# EAGLE design BalanceBot (EAGLE 9.6.2)
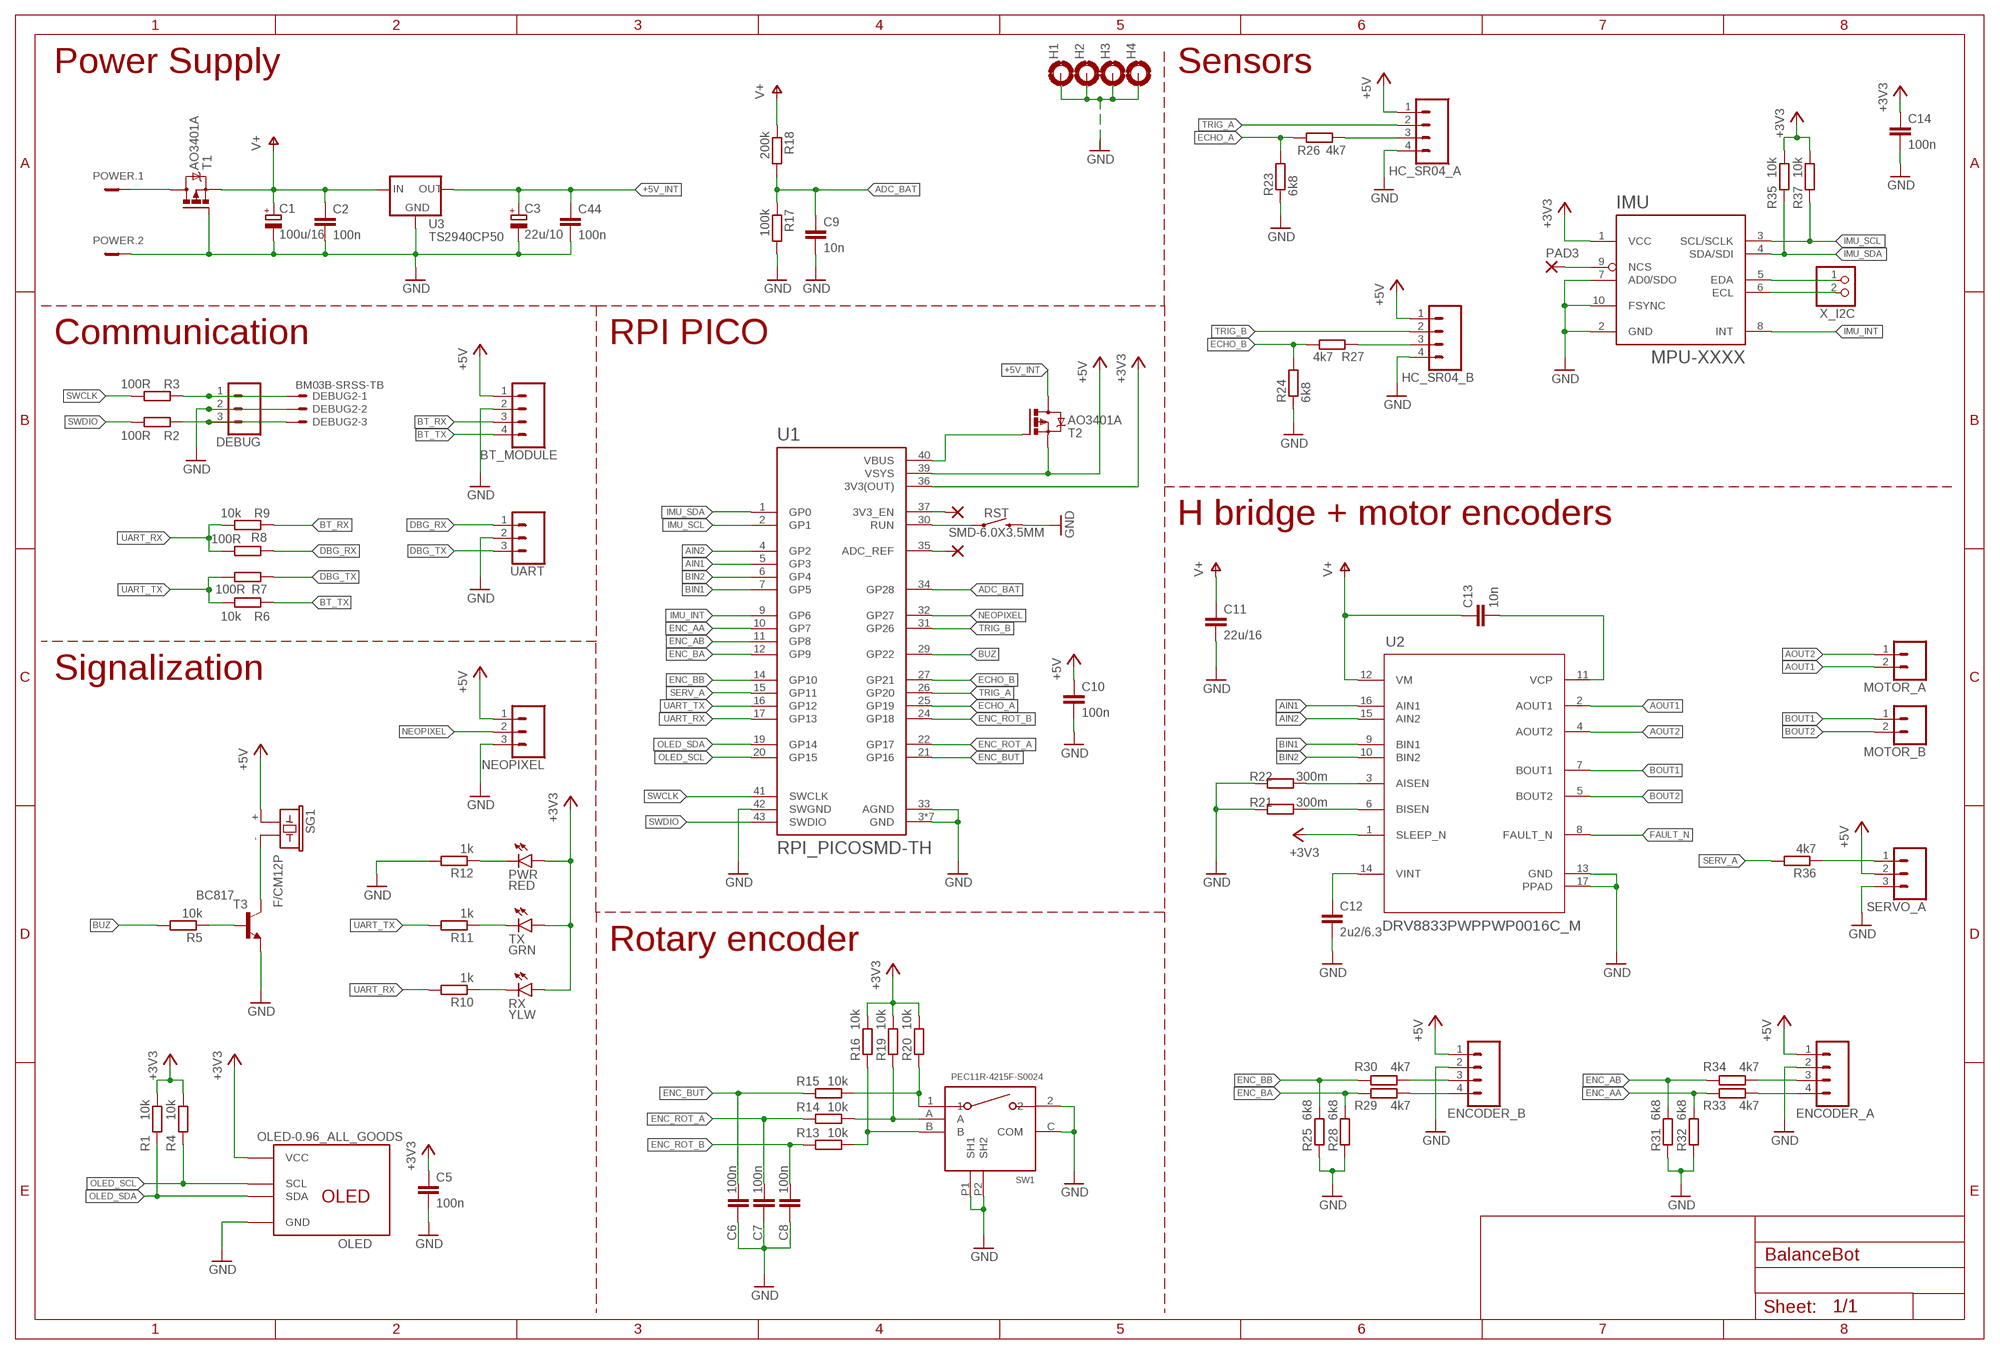
[diagram p0: schematic, sheet 1]

## Parts
BT_MODULE  JST-XH-04-PIN-LONG-PAD  [JST-XH-04-PACKAGE-LONG-PAD]
C1  100u/16  CPOL-EUE2-5  [E2-5]
C2  100n  C-EUC0805  [C0805]
C3  22u/10  CPOL-EUSMCB  [SMC_B]
C5  100n  C-EUC0805  [C0805]
C6  100n  C-EUC0805  [C0805]
C7  100n  C-EUC0805  [C0805]
C8  100n  C-EUC0805  [C0805]
C9  10n  C-EUC0805  [C0805]
C10  100n  C-EUC0805  [C0805]
C11  22u/16  C-EUC0805  [C0805]
C12  2u2/6.3  C-EUC0805  [C0805]
C13  10n  C-EUC0805  [C0805]
C14  100n  C-EUC0805  [C0805]
C44  100n  C-EUC0805  [C0805]
DEBUG  JST-XH-03-PIN-LONG-PAD  [JST-XH-03-PACKAGE-LONG-PAD]
DEBUG2  BM03B-SRSS-TB  [BM03B-SRSS-TB]
ENCODER_A  JST-XH-04-PIN-LONG-PAD  [JST-XH-04-PACKAGE-LONG-PAD]
ENCODER_B  JST-XH-04-PIN-LONG-PAD  [JST-XH-04-PACKAGE-LONG-PAD]
H1  MOUNT-PAD-ROUND3.2  [3,2-PAD]
H2  MOUNT-PAD-ROUND3.2  [3,2-PAD]
H3  MOUNT-PAD-ROUND3.2  [3,2-PAD]
H4  MOUNT-PAD-ROUND3.2  [3,2-PAD]
HC_SR04_A  JST-XH-04-PIN-LONG-PAD  [JST-XH-04-PACKAGE-LONG-PAD]
HC_SR04_B  JST-XH-04-PIN-LONG-PAD  [JST-XH-04-PACKAGE-LONG-PAD]
IMU  MPU-XXXX  [MPUXXXX]
MOTOR_A  JST-XH-02-PIN-LONG-PAD  [JST-XH-02-PACKAGE-LONG-PAD]
MOTOR_B  JST-XH-02-PIN-LONG-PAD  [JST-XH-02-PACKAGE-LONG-PAD]
NEOPIXEL  JST-XH-03-PIN-LONG-PAD  [JST-XH-03-PACKAGE-LONG-PAD]
OLED  OLED-0.96_ALL_GOODS  [ALL_GOODS]
PAD1  WIREPADSMD1,27-254  [SMD1,27-2,54]
PAD2  WIREPADSMD1,27-254  [SMD1,27-2,54]
PAD3  WIREPADSMD1,27-254  [SMD1,27-2,54]
POWER  MCV2  [MCV2]
PWR  RED  LEDCHIP-LED0805  [CHIP-LED0805]
R1  10k  R-EU_R0805  [R0805]
R2  100R  R-EU_R0805  [R0805]
R3  100R  R-EU_R0805  [R0805]
R4  10k  R-EU_R0805  [R0805]
R5  10k  R-EU_R0805  [R0805]
R6  10k  R-EU_R0805  [R0805]
R7  100R  R-EU_R0805  [R0805]
R8  100R  R-EU_R0805  [R0805]
R9  10k  R-EU_R0805  [R0805]
R10  1k  R-EU_R0805  [R0805]
R11  1k  R-EU_R0805  [R0805]
R12  1k  R-EU_R0805  [R0805]
R13  10k  R-EU_R0805  [R0805]
R14  10k  R-EU_R0805  [R0805]
R15  10k  R-EU_R0805  [R0805]
R16  10k  R-EU_R0805  [R0805]
R17  100k  R-EU_R0805  [R0805]
R18  200k  R-EU_R0805  [R0805]
R19  10k  R-EU_R0805  [R0805]
R20  10k  R-EU_R0805  [R0805]
R21  300m  R-EU_R1206  [R1206]
R22  300m  R-EU_R1206  [R1206]
R23  6k8  R-EU_R0805  [R0805]
R24  6k8  R-EU_R0805  [R0805]
R25  6k8  R-EU_R0805  [R0805]
R26  4k7  R-EU_R0805  [R0805]
R27  4k7  R-EU_R0805  [R0805]
R28  6k8  R-EU_R0805  [R0805]
R29  4k7  R-EU_R0805  [R0805]
R30  4k7  R-EU_R0805  [R0805]
R31  6k8  R-EU_R0805  [R0805]
R32  6k8  R-EU_R0805  [R0805]
R33  4k7  R-EU_R0805  [R0805]
R34  4k7  R-EU_R0805  [R0805]
R35  10k  R-EU_R0805  [R0805]
R36  4k7  R-EU_R0805  [R0805]
R37  10k  R-EU_R0805  [R0805]
RST  SMD-6.0X3.5MM  MOMENTARY-SWITCH-SPST-SMD-6.0X3.5MM  [TACTILE_SWITCH_SMD_6.0X3.5MM]
RX  YLW  LEDCHIP-LED0805  [CHIP-LED0805]
SERVO_A  JST-XH-03-PIN-LONG-PAD  [JST-XH-03-PACKAGE-LONG-PAD]
SG1  F/CM12P  [F/CM12P]
SW1  PEC11R-4215F-S0024  [PEC11R-4215F-S0024]
T1  AO3401A  PMOSFET_SOT23-GSD  [SOT23]
T2  AO3401A  PMOSFET_SOT23-GSD  [SOT23]
T3  BC817  BC817-NPN-SOT23-BEC  [SOT23-BEC]
TX  GRN  LEDCHIP-LED0805  [CHIP-LED0805]
U1  RPI_PICOSMD-TH  RASPBERRY_PICOTH-ONLY  [PICO-PKG-TH-ONLY]
U2  DRV8833PWPPWP0016C_M  [PWP0016C_M]
U3  TS2940CP50  LP2950CDT-5.0  [DPACK]
UART  JST-XH-03-PIN-LONG-PAD  [JST-XH-03-PACKAGE-LONG-PAD]
X_I2C  PINHD-1X2  [1X02]

## Nets
3V3_EN: PAD2.1(P) U1.37(3V3_EN)
+3V3: C5.1 C14.1 IMU.1(VCC) OLED.2(VCC) PWR.A R1.1 R4.1 R16.1 R19.1 R20.1 R35.1 R37.1 RX.A TX.A U1.36(3V3(OUT)) U2.1(SLEEP_N)
+5V: BT_MODULE.1 C10.1 ENCODER_A.1 ENCODER_B.1 HC_SR04_A.1 HC_SR04_B.1 NEOPIXEL.1 SERVO_A.2 SG1.+ T2.2(S) U1.39(VSYS)
+5V_INT: C3.+ C44.1 T2.3(D) U3.3(OUT)
ADC_BAT: C9.1 R17.1 R18.2 U1.34(GP28)
ADC_REF: PAD1.1(P) U1.35(ADC_REF)
AIN1: U1.5(GP3) U2.16(AIN1)
AIN2: U1.4(GP2) U2.15(AIN2)
AOUT1: MOTOR_A.2 U2.2(AOUT1)
AOUT2: MOTOR_A.1 U2.4(AOUT2)
BIN1: U1.7(GP5) U2.9(BIN1)
BIN2: U1.6(GP4) U2.10(BIN2)
BOUT1: MOTOR_B.1 U2.7(BOUT1)
BOUT2: MOTOR_B.2 U2.5(BOUT2)
BT_RX: BT_MODULE.3 R9.1
BT_TX: BT_MODULE.4 R6.1
BUZ: R5.2 U1.29(GP22)
DBG_RX: R8.1 UART.1
DBG_TX: R7.1 UART.3
ECHO_A: R23.2 R26.1 U1.25(GP19)
ECHO_B: R24.2 R27.1 U1.27(GP21)
ECL: IMU.6(ECL) X_I2C.2
EDA: IMU.5(EDA) X_I2C.1
ENC_AA: R32.2 R33.1 U1.10(GP7)
ENC_AB: R31.2 R34.2 U1.11(GP8)
ENC_BA: R28.2 R29.1 U1.12(GP9)
ENC_BB: R25.2 R30.2 U1.14(GP10)
ENC_BUT: C6.1 R15.1 U1.21(GP16)
ENC_ROT_A: C7.1 R14.1 U1.22(GP17)
ENC_ROT_B: C8.1 R13.1 U1.24(GP18)
FAULT_N: U2.8(FAULT_N)
GND: BT_MODULE.2 C1.- C2.2 C3.- C5.2 C6.2 C7.2 C8.2 C9.2 C10.2 C11.2 C12.2 C14.2 C44.2 DEBUG2.2 DEBUG.2 ENCODER_A.2 ENCODER_B.2 H1.B3,2(MOUNT) H2.B3,2(MOUNT) H3.B3,2(MOUNT) H4.B3,2(MOUNT) HC_SR04_A.4 HC_SR04_B.4 IMU.2(GND) IMU.7(AD0/SDO) IMU.10(FSYNC) NEOPIXEL.3 OLED.1(GND) POWER.2 R12.2 R17.2 R21.1 R22.1 R23.1 R24.1 R25.1 R28.1 R31.1 R32.1 RST.2 SERVO_A.3 SW1.2 SW1.C(COM) SW1.P1(SH1) SW1.P2(SH2) T1.1(G) T3.E U1.3(GND) U1.8(GND) U1.13(GND) U1.18(GND) U1.23(GND) U1.28(GND) U1.33(AGND) U1.38(GND) U1.42(SWGND) U2.13(GND) U2.17(PPAD) U3.4(GND) UART.2
IMU_INT: IMU.8(INT) U1.9(GP6)
IMU_SCL: IMU.3(SCL/SCLK) R37.2 U1.2(GP1)
IMU_SDA: IMU.4(SDA/SDI) R35.2 U1.1(GP0)
N$1: R22.2 U2.3(AISEN)
N$2: R21.2 U2.6(BISEN)
N$3: C13.2 U2.11(VCP)
N$4: C12.1 U2.14(VINT)
N$8: POWER.1 T1.3(D)
N$9: PWR.C R12.1
N$10: R11.1 TX.C
N$11: R15.2 R20.2 SW1.1
N$12: R5.1 T3.B
N$13: R14.2 R19.2 SW1.A
N$14: SG1.- T3.C
N$15: R13.2 R16.2 SW1.B
N$20: R10.1 RX.C
N$23: HC_SR04_A.3 R26.2
N$24: HC_SR04_B.3 R27.2
N$25: ENCODER_A.3 R34.1
N$26: ENCODER_A.4 R33.2
N$27: ENCODER_B.3 R30.1
N$28: ENCODER_B.4 R29.2
N$30: DEBUG2.1 DEBUG.1 R3.1
N$32: R36.1 SERVO_A.1
N$33: DEBUG2.3 DEBUG.3 R2.2
NCS: IMU.9(NCS) PAD3.1(P)
NEOPIXEL: NEOPIXEL.2 U1.32(GP27)
OLED_SCL: OLED.3(SCL) R4.2 U1.20(GP15)
OLED_SDA: OLED.4(SDA) R1.2 U1.19(GP14)
RUN: RST.1 U1.30(RUN)
SERV_A: R36.2 U1.15(GP11)
SWCLK: R3.2 U1.41(SWCLK)
SWDIO: R2.1 U1.43(SWDIO)
TRIG_A: HC_SR04_A.2 U1.26(GP20)
TRIG_B: HC_SR04_B.2 U1.31(GP26)
UART_RX: R8.2 R9.2 R10.2 U1.17(GP13)
UART_TX: R6.2 R7.2 R11.2 U1.16(GP12)
V+: C1.+ C2.1 C11.1 C13.1 R18.1 T1.2(S) U2.12(VM) U3.1(IN)
VBUS: T2.1(G) U1.40(VBUS)

## Notes on the sheet
- Power Supply | Sensors
- Communication | RPI PICO
- H bridge + motor encoders
- Signalization
- Rotary encoder

## Library data of the parts
BT_MODULE ENCODER_A ENCODER_B HC_SR04_A HC_SR04_B = JST-XH-2.54:JST-XH-04-PIN: JST XH Connector 2 Pin Wire to board connector. Pitch: 2,54 mm, (0.100") Number of pins: 4 Created by Rembrandt Electronics www.rembrandtelectronics.com
C1 C3 = rcl:CPOL-EU: POLARIZED CAPACITOR, European symbol; SPICEPREFIX: C
C2 C5-C14 C44 = rcl:C-EU: CAPACITOR, European symbol; SPICEPREFIX: C
DEBUG NEOPIXEL SERVO_A UART = JST-XH-2.54:JST-XH-03-PIN: JST XH Connector 2 Pin Wire to board connector. Pitch: 2,54 mm, (0.100") Number of pins: 3 Created by Rembrandt Electronics www.rembrandtelectronics.com
DEBUG2 = con-jst2:?M03B-SRSS-TB: Disconnectable Crimp style connector, 1.0mm pitch 3 contacts
H1-H4 = tcs_holes:MOUNT-PAD-ROUND: MOUNTING PAD, round
IMU = MPU_sensors:MPU-XXXX
MOTOR_A MOTOR_B = JST-XH-2.54:JST-XH-02-PIN: JST XH Connector 2 Pin Wire to board connector. Pitch: 2,54 mm, (0.100") Number of pins: 2 Created by Rembrandt Electronics www.rembrandtelectronics.com
OLED = oled:OLED-0.96_
PAD1-PAD3 = wirepad:WIREPAD: Wire PAD connect wire on PCB
POWER = con-phoenix-381_l:MCV2: Mini-Combicon 3.81mm vertikal 2polig MCV 1,5/2-G-3,81 Artikel-Nr. 1803426
PWR RX TX = led:LED: LED OSRAM: - CHIPLED LG R971, LG N971, LY N971, LG Q971, LY Q971, LO R971, LY R971 LH N974, LH R974 LS Q976, LO Q976, LY Q976 LO Q996 - Hyper CHIPLED LW Q18S LB Q993, LB Q99A, LB R99A - SideLED LS A670, LO A670, LY A670, LG A670, LP A670 LB A673, LV A673, LT A673, LW A673 LH A674 LY A675 LS A676, LA A676, LO A676, LY A676, LW A676 LS A679, LY A679, LG A679 - Hyper Micro SIDELED® LS Y876, LA Y876, LO Y876, LY Y876 LT Y87S - SmartLED LW L88C, LW L88S LB L89C, LB L89S, LG L890 LS L89K, LO L89K, LY L89K LS L896, LA L896, LO L896, LY L896 - TOPLED LS T670, LO T670, LY T670, LG T670, LP T670 LSG T670, LSP T670, LSY T670, LOP T670, LYG T670 LG T671, LOG T671, LSG T671 LB T673, LV T673, LT T673, LW T673 LH T674 LS T676, LA T676, LO T676, LY T676, LB T676, LH T676, LSB T676, LW T676 LB T67C, LV T67C, LT T67C, LS T67K, LO T67K, LY T67K, LW E67C LS E67B, LA E67B, LO E67B, LY E67B, LB E67C, LV E67C, LT E67C LW T67C LS T679, LY T679, LG T679 LS T770, LO T770, LY T770, LG T770, LP T770 LB T773, LV T773, LT T773, LW T773 LH T774 LS E675, LA E675, LY E675, LS T675 LS T776, LA T776, LO T776, LY T776, LB T776 LHGB T686 LT T68C, LB T68C - Hyper Mini TOPLED® LB M676 - Mini TOPLED Santana® LG M470 LS M47K, LO M47K, LY M47K Source: http://www.osram.convergy.de LUXEON: - LUMILED® LXK2-PW12-R00, LXK2-PW12-S00, LXK2-PW14-U00, LXK2-PW14-V00 LXK2-PM12-R00, LXK2-PM12-S00, LXK2-PM14-U00 LXK2-PE12-Q00, LXK2-PE12-R00, LXK2-PE12-S00, LXK2-PE14-T00, LXK2-PE14-U00 LXK2-PB12-K00, LXK2-PB12-L00, LXK2-PB12-M00, LXK2-PB14-N00, LXK2-PB14-P00, LXK2-PB14-Q00 LXK2-PR12-L00, LXK2-PR12-M00, LXK2-PR14-Q00, LXK2-PR14-R00 LXK2-PD12-Q00, LXK2-PD12-R00, LXK2-PD12-S00 LXK2-PH12-R00, LXK2-PH12-S00 LXK2-PL12-P00, LXK2-PL12-Q00, LXK2-PL12-R00 Source: www.luxeon.com KINGBRIGHT: KA-3528ASYC Source: www.kingbright.com
R1-R37 = rcl:R-EU_: RESISTOR, European symbol; SPICEPREFIX: R
RST = SparkFun-Switches:MOMENTARY-SWITCH-SPST: Momentary Switch (Pushbutton) - SPST Normally-open (NO) SPST momentary switches (buttons, pushbuttons). Variants PTH-12MM - 12mm square, through-hole Momentary Pushbutton Switch - 12mm Square <https://www.sparkfun.com/products/9190> (COM-09190) PTH-6.0MM, PTH-6.0MM-KIT - 6.0mm square, through-hole Mini Pushbutton Switch <https://www.sparkfun.com/products/97> (COM-00097) KIT package intended for soldering kit's - only one side of pads' copper is exposed. PTH-RIGHT-ANGLE-KIT - Right-angle, through-hole Right Angle Tactile Button <https://www.sparkfun.com/products/10791> - Used on SparkFun BigTime Watch Kit <https://www.sparkfun.com/products/11734> SMD-12MM - 12mm square, surface-mount Tactile Button - SMD (12mm) <https://www.sparkfun.com/products/12993> (COM-12993) Used on SparkFun PicoBoard <https://www.sparkfun.com/products/11888> SMD-4.5MM - 4.5mm Square Trackball Switch Used on SparkFun Blackberry Trackballer Breakout <https://www.sparkfun.com/products/13169> SMD-4.6MMX2.8MM - 4.60mm x 2.80mm, surface mount Used on SparkFun SAMD21 Mini Breakout <https://www.sparkfun.com/products/13664> SMD-5.2MM, SMD-5.2-REDUNDANT - 5.2mm square, surface-mount Mini Pushbutton Switch - SMD <https://www.sparkfun.com/products/8720> (COM-08720) Used on Arduino Pro Mini <https://www.sparkfun.com/products/11114> REDUNDANT package connects both switch circuits together SMD-6.0X3.5MM - 6.0 x 3.5mm, surface mount Momentary Reset Switch SMD <https://www.sparkfun.com/products/8229> (COM-08229) SMD-6.2MM-TALL - 6.2mm square, surface mount Tactile Button - SMD (6mm) <https://www.sparkfun.com/products/12992> Used on SparkFun Digital Sandbox <https://www.sparkfun.com/products/12651> SMD-RIGHT-ANGLE - Right-angle, surface mount Used on SparkFun Block for Intel® Edison - Arduino <https://www.sparkfun.com/products/13036>; PROD_ID: SWCH-00815; SF_SKU: COM-08229
SG1 = buzzer:F/CM12P: BUZZER Source: Buerklin; OC_FARNELL: unknown; OC_NEWARK: unknown
SW1 = EC11_encoder:PEC11R-4215F-S0024: ROTARY ENCODER MECHANICAL 24PPR Manufacturer's datasheet <https://www.bourns.com/docs/Product-Datasheets/PEC11R.pdf>; CREATED_BY: PCBLayout.com; DIGIKEY_PART_NUMBER: PEC11R-4215F-S0024-ND; MANUFACTURER: Bourns Inc.; MPN: PEC11R-4215F-S0024
T1 T2 = Transistor:PMOSFET: P-Channel MOSFET - Generic; CATEGORY: Transistor; SUB-CATEGORY: MOSFET; TYPE: P-Channel; VALUE: PMOSFET
T3 = transistor:*-NPN-: NPN Transistror BF959 corrected 2008.03.06
U1 = RpiPico:RASPBERRY_PICO: Raspberry Pi Pico
U2 = DRV8833:DRV8833PWP; COPYRIGHT: Copyright (C) 2023 Ultra Librarian. All rights reserved.; MANUFACTURER_PART_NUMBER: DRV8833PWP; MFR_NAME: Texas Instruments; REFDES: RefDes; TYPE: TYPE
U3 = v-reg:LP2950?*: Source: http://cache.national.com/ds/LP/LP2950.pdf
X_I2C = pinhead:PINHD-1X2: PIN HEADER

## Board
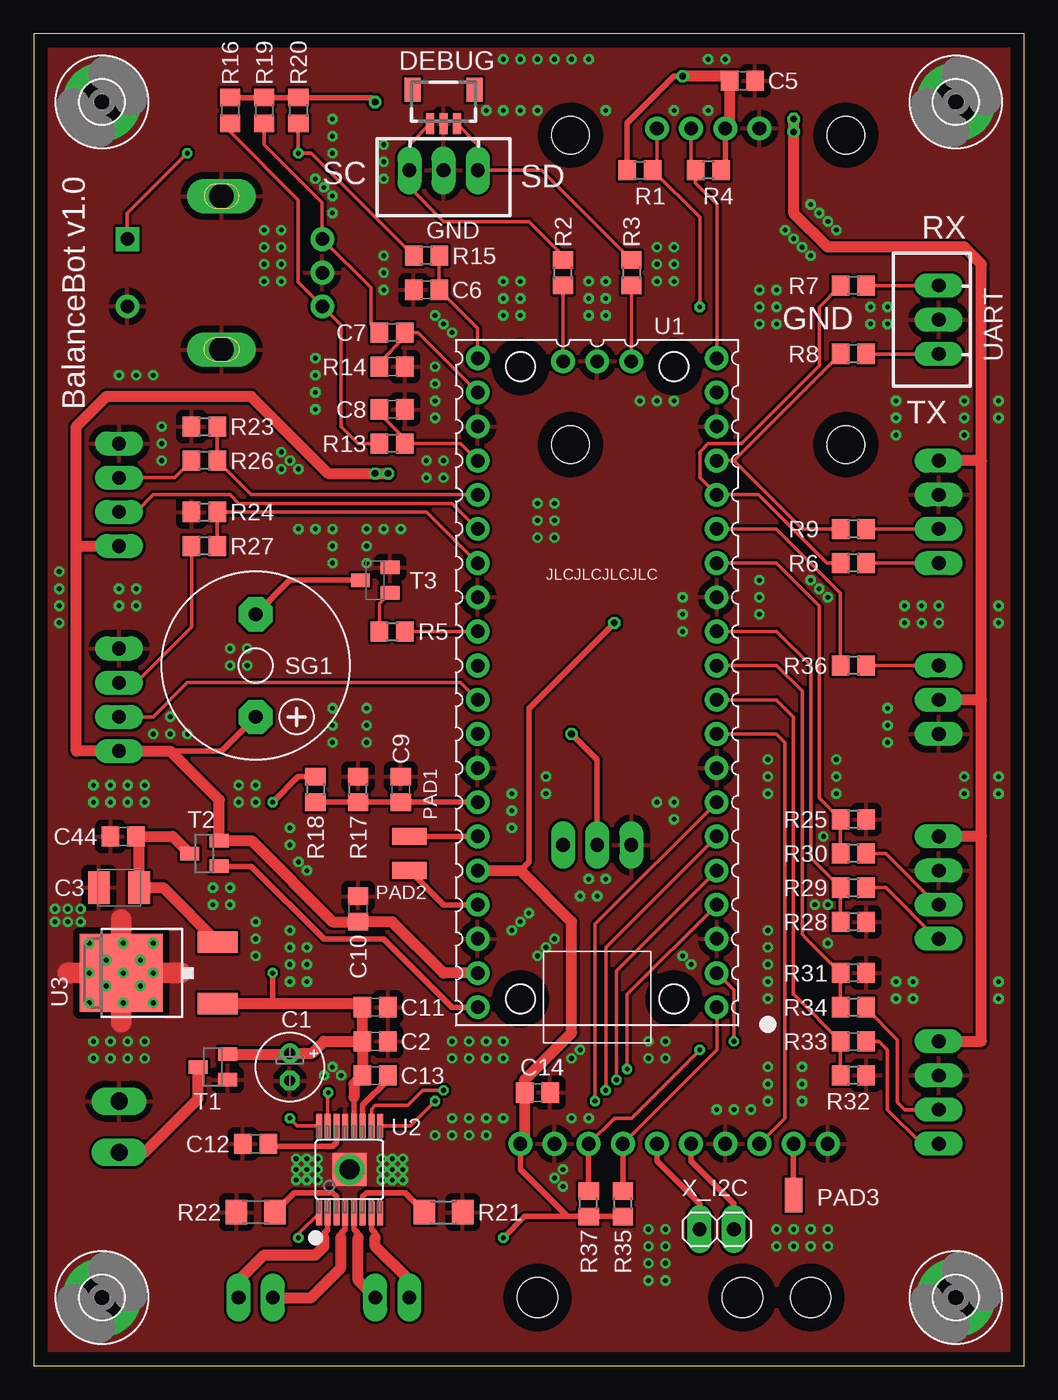
[diagram p1: board, top side]
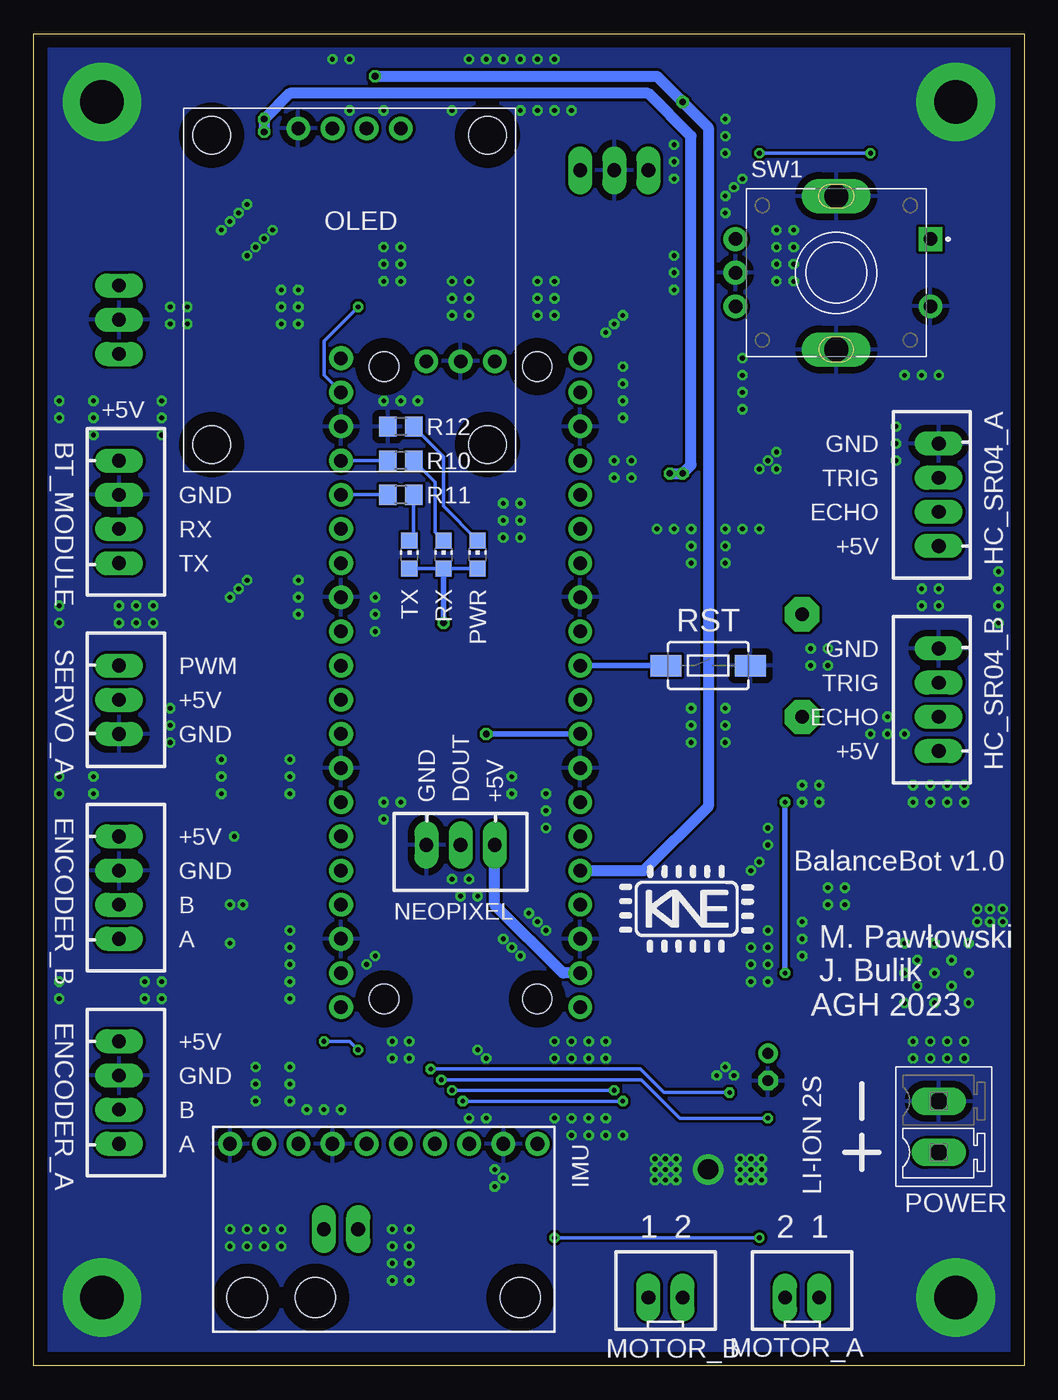
[diagram p2: board, bottom side, seen from below]

Size 73.66 x 99.06 mm. Coordinates in mm from the lower left corner, seen from the top.
Outline: 0,0 73.66,0 73.66,99.06 0,99.06 0,0
Copper layers (1*16): Top 0.035mm / dielectric 1.6mm / Bottom 0.035mm
Design rules "maro_jlc *": minimum track width 8mil, minimum drill 0.35mm, track to track 8mil, track to pad 8mil, pad to pad 8mil, via to via 8mil, smd to smd 8mil, copper to edge 40mil, drill to drill 10mil, minimum pad ring 10mil, minimum via ring 8mil, stop-mask expansion 4mil, vias tented up to drill 0.6mm, thermal gap 20mil

### Footprints (pad centres in the part's own frame; a part is rotated, then mirrored left to right if it is on the bottom)
JST-XH-04-PACKAGE-LONG-PAD = drill 1.016 long: 1 -3.81,0; 2 -1.27,0; 3 1.27,0; 4 3.81,0
E2-5 = drill 0.813 pad 1.27: + -1.016,0 | drill 0.813 pad 1.27 octagon: - 1.016,0
C0805 = smd 1.3 x 1.5: 1 -0.95,0; 2 0.95,0
SMC_B = smd 1.6 x 2.4: + -1.5,0; - 1.5,0
JST-XH-03-PACKAGE-LONG-PAD = drill 1.016 long: 1 -2.54,0; 2 0,0; 3 2.54,0
BM03B-SRSS-TB = smd 0.6 x 1.55: 1 1,-1.625; 2 0,-1.625; 3 -1,-1.625 | smd 1.2 x 1.8: FIT@1 2.3,0.9; FIT@2 -2.3,0.9
3,2-PAD = drill 3.2 pad 5.842: B3,2 0,0
MPUXXXX = drill 1.016: 1 0,11.43; 2 0,8.89; 3 0,6.35; 4 0,3.81; 5 0,1.27; 6 0,-1.27; 7 0,-3.81; 8 0,-6.35; 9 0,-8.89; 10 0,-11.43 | hole 3: 11.43,10.16; 11.43,-10.16; 11.43,-5.08
JST-XH-02-PACKAGE-LONG-PAD = drill 1.016 long: 1 -1.27,0; 2 1.27,0
ALL_GOODS = drill 1.016: 1 -3.81,12; 2 -1.27,12; 3 1.27,12; 4 3.81,12 | hole 2.8: -10.25,11.5; 10.25,11.5; -10.25,-11.5; 10.25,-11.5
SMD1,27-2,54 = smd 1.27 x 2.54: 1 0,0
MCV2 = drill 1.27 pad 1.905 long: 1 -1.905,0; 2 1.905,0
CHIP-LED0805 = smd 1.2 x 1.2: A 0,-1.05; C 0,1.05
R0805 = smd 1.3 x 1.5: 1 -0.95,0; 2 0.95,0
R1206 = smd 1.6 x 1.803: 1 -1.422,0; 2 1.422,0
TACTILE_SWITCH_SMD_6.0X3.5MM = smd 2.3 x 1.6: 1 -3.15,0; 2 3.15,0
F/CM12P = drill 1.016 pad 2.54 octagon: + 3.81,0; - -3.81,0
PEC11R-4215F-S0024 = drill 1 square: 1 -2.5,7 | drill 1: 2 2.5,7; A -2.5,-7.5; B 2.5,-7.5; C 0,-7.5 | drill 1.8 long: P1 -5.7,0; P2 5.7,0
SOT23 = smd 1 x 1.4: 1 -0.95,-1.1; 2 0.95,-1.1; 3 0,1.1
SOT23-BEC = smd 1 x 1.4: B -0.95,-1.1; C 0,1.1; E 0.95,-1.1
PICO-PKG-TH-ONLY = drill 1: 1 -8.89,24.13; 2 -8.89,21.59; 3 -8.89,19.05; 4 -8.89,16.51; 5 -8.89,13.97; 6 -8.89,11.43; 7 -8.89,8.89; 8 -8.89,6.35; 9 -8.89,3.81; 10 -8.89,1.27; 11 -8.89,-1.27; 12 -8.89,-3.81; 13 -8.89,-6.35; 14 -8.89,-8.89; 15 -8.89,-11.43; 16 -8.89,-13.97; 17 -8.89,-16.51; 18 -8.89,-19.05; 19 -8.89,-21.59; 20 -8.89,-24.13; 21 8.89,-24.13; 22 8.89,-21.59; 23 8.89,-19.05; 24 8.89,-16.51; 25 8.89,-13.97; 26 8.89,-11.43; 27 8.89,-8.89; 28 8.89,-6.35; 29 8.89,-3.81; 30 8.89,-1.27; 31 8.89,1.27; 32 8.89,3.81; 33 8.89,6.35; 34 8.89,8.89; 35 8.89,11.43; 36 8.89,13.97; 37 8.89,16.51; 38 8.89,19.05; 39 8.89,21.59; 40 8.89,24.13; 41 -2.54,-23.9; 42 0,-23.9; 43 2.54,-23.9 | hole 2.2: 5.7,-23.5; -5.7,-23.5; -5.7,23.5; 5.7,23.5
PWP0016C_M = smd 1.8 x 0.447: 1 -3.25,2.275; 2 -3.25,1.625; 3 -3.25,0.975; 4 -3.25,0.325; 5 -3.25,-0.325; 6 -3.25,-0.975; 7 -3.25,-1.625; 8 -3.25,-2.275; 9 3.25,-2.275; 10 3.25,-1.625; 11 3.25,-0.975; 12 3.25,-0.325; 13 3.25,0.325; 14 3.25,0.975; 15 3.25,1.625; 16 3.25,2.275 | smd 2.46 x 2.56: 17 0,0
DPACK = smd 1.6 x 3: 1 -2.28,-4.8; 3 2.28,-4.8 | smd 5.8 x 6.2: 4 0,2.38
1X02 = drill 1.016 long: 1 -1.27,0; 2 1.27,0

### Placement (x,y rotation side)
BT_MODULE  67.31,63.5 270 bottom
C1  19.05,22.23 270 top
C2  25.4,24.13 0 top
C3  6.35,35.56 180 top
C5  52.7,95.57 0 top
C6  29.21,80.01 180 top
C7  26.67,74.3 0 top
C8  26.67,71.12 0 top
C9  27.3,42.86 90 top
C10  24.13,33.97 90 top
C11  25.4,26.67 0 top
C12  16.51,16.51 180 top
C13  25.4,21.59 0 top
C14  37.47,20.32 0 top
C44  6.67,39.37 180 top
DEBUG  30.48,88.9 180 top
DEBUG2  30.48,93.98 0 top
ENCODER_A  67.31,20.32 270 bottom
ENCODER_B  67.31,35.56 270 bottom
H1  68.58,5.08 0 top
H2  5.08,5.08 0 top
H3  68.58,93.98 0 top
H4  5.08,93.98 0 top
HC_SR04_A  6.35,64.77 90 bottom
HC_SR04_B  6.35,49.53 90 bottom
IMU  47.62,16.51 270 bottom
MOTOR_A  16.51,5.08 0 bottom
MOTOR_B  26.67,5.08 0 bottom
NEOPIXEL  41.91,38.73 180 bottom
OLED  50.16,80.01 0 bottom
PAD1  27.94,39.37 90 top
PAD2  27.94,36.83 90 top
PAD3  56.52,12.7 0 top
POWER  6.35,17.78 90 bottom
PWR  40.64,60.33 0 bottom
R1  45.09,88.9 0 top
R2  39.37,81.28 90 top
R3  44.45,81.28 270 top
R4  50.16,88.9 180 top
R5  26.67,54.61 0 top
R6  60.96,59.69 180 top
R7  60.96,80.33 180 top
R8  60.96,75.25 180 top
R9  60.96,62.23 180 top
R10  46.35,67.31 180 bottom
R11  46.35,64.77 180 bottom
R12  46.35,69.85 180 bottom
R13  26.67,68.58 180 top
R14  26.67,76.83 180 top
R15  29.21,82.55 180 top
R16  14.61,93.34 270 top
R17  24.13,42.86 90 top
R18  20.95,42.86 270 top
R19  17.14,93.34 270 top
R20  19.68,93.34 270 top
R21  30.48,11.43 180 top
R22  16.51,11.43 0 top
R23  12.7,69.85 0 top
R24  12.7,63.5 0 top
R25  60.96,40.64 180 top
R26  12.7,67.31 180 top
R27  12.7,60.96 180 top
R28  60.96,33.02 180 top
R29  60.96,35.56 0 top
R30  60.96,38.1 180 top
R31  60.96,29.21 180 top
R32  60.96,21.59 180 top
R33  60.96,24.13 0 top
R34  60.96,26.67 180 top
R35  43.81,12.06 90 top
R36  60.96,52.07 180 top
R37  41.27,12.06 90 top
RST  23.5,52.07 0 bottom
RX  43.18,60.33 0 bottom
SERVO_A  67.31,49.53 270 bottom
SG1  16.51,52.07 270 top
SW1  13.97,81.28 270 bottom
T1  13.34,22.23 90 top
T2  12.7,38.1 90 top
T3  25.4,58.42 90 top
TX  45.72,60.33 0 bottom
U1  41.91,50.8 180 top
U2  23.5,14.61 90 top
U3  8.89,29.21 90 top
UART  67.31,77.79 90 top
X_I2C  50.8,10.16 0 top

### Tracks (layer width: path | path; a pad name or v marks a point on that pad's centre or on a via)
3V3_EN
  Top 0.406: U1.37 30.48,34.29 PAD2.1
+3V3  (via drill 0.35, 0.5)
  Top 0.254: v19.68,9.53 19.68,9.82 U2.1
  Top 0.406: 39.69,11.12 R37.1 R35.1 | 39.69,11.12 36.2,14.61 IMU.1 | OLED.2 51.44,89.22 R4.1 | v48.26,95.89 47.62,95.89 44.13,92.39 R1.1 | R16.1 R19.1 R20.1 25.09,94.3 v25.4,93.98 | v34.92,9.53 36.52,11.12 39.69,11.12 | 36.2,36.83 36.83,37.47 36.83,48.9 v43.18,55.24
  Top 0.813: IMU.1 36.52,16.83 C14.1 36.52,21.27 40.01,24.77 40.01,33.02 36.2,36.83 U1.36 | v48.26,95.89 51.44,95.89 C5.1 51.76,92.33 OLED.2
  Bottom 0.254: v19.68,9.53 v34.92,9.53 | PWR.A RX.A TX.A
  Bottom 0.406: v43.18,55.24 RX.A
  Bottom 0.813: v48.26,95.89 27.3,95.89 v25.4,93.98 23.5,92.08 23.5,41.59 28.26,36.83 U1.36
+5V  (via drill 0.5)
  Top 0.406: 10.16,45.72 13.97,45.72 SG1.+
  Top 0.813: 3.17,60.96 3.17,45.72 HC_SR04_B.1 10.16,45.72 13.8,42.08 T2.2 16.2,39.05 22.22,33.02 C10.1 26.67,33.02 30.48,29.21 U1.39 | 3.17,60.96 HC_SR04_A.1 | ENCODER_A.1 70.48,24.13 70.48,39.37 | 70.48,39.37 ENCODER_B.1 | 70.48,39.37 70.48,49.53 | 70.48,49.53 SERVO_A.2 | 70.48,49.53 70.48,67.31 | 70.48,67.31 BT_MODULE.1 | 3.17,60.96 3.17,69.85 5.4,72.07 16.19,72.07 21.91,66.36 v25.4,66.36 v26.35,66.36 | 70.48,67.31 70.48,81.92 69.22,83.19 59.05,83.19 56.52,85.72 v56.52,91.76 v56.52,92.71
  Bottom 0.813: v26.35,66.36 v25.4,66.36 24.77,66.99 24.77,91.44 27.94,94.61 54.61,94.61 v56.52,92.71 v56.52,91.76 | U1.39 34.29,29.21 39.37,34.29 NEOPIXEL.1
+5V_INT
  Top 0.813: T2.3 10.33,39.37 C44.1 7.85,39.14 C3.+ 9.62,35.56 U3.3
ADC_BAT
  Top 0.406: R18.2 R17.1 C9.1 U1.34
ADC_REF
  Top 0.406: PAD1.1 U1.35
AIN1  (via drill 0.35)
  Top 0.254: U2.16 19.61,17.86 v19.05,18.41 | v43.34,21.27 43.34,29.37 U1.5
  Bottom 0.254: v19.05,18.41 25.6,18.41 28.45,21.27 v43.34,21.27
AIN2  (via drill 0.35)
  Top 0.254: U2.15 21.87,20.28 v21.91,20.32 | U1.4 44.13,27.62 v44.13,22.07
  Bottom 0.254: v21.91,20.32 26.78,20.32 28.53,22.07 v44.13,22.07
AOUT1
  Top 0.406: U2.2 21.87,10.12 21.59,9.84 21.59,9.53
  Top 0.813: MOTOR_A.2 15.24,6.35 17.14,8.26 20.95,8.26 21.59,8.89 21.59,9.53
AOUT2
  Top 0.406: U2.4 23.17,10.16 22.86,9.85 22.86,9.53
  Top 0.813: MOTOR_A.1 20.64,5.08 22.86,7.3 22.86,9.53
BIN1  (via drill 0.35)
  Top 0.254: v29.84,19.68 28.02,17.86 U2.9 | U1.7 41.75,32.86 v41.75,19.68
  Bottom 0.254: v41.75,19.68 v29.84,19.68
BIN2  (via drill 0.35)
  Top 0.254: U2.10 25.12,19.09 25.4,19.37 27.82,19.37 28.93,20.48 v30.48,20.48 | v42.55,20.48 42.55,31.11 U1.6
  Bottom 0.254: v42.55,20.48 v30.48,20.48
BOUT1
  Top 0.406: U2.7 25.12,10.16 25.4,9.88 25.4,9.53
  Top 0.813: MOTOR_B.1 27.94,6.35 25.4,8.89 25.4,9.53
BOUT2
  Top 0.406: U2.5 23.82,10.16 24.13,9.85 24.13,9.53
  Top 0.813: MOTOR_B.2 24.13,6.35 24.13,9.53
BT_RX
  Top 0.254: R9.1 BT_MODULE.3
BT_TX
  Top 0.254: R6.1 BT_MODULE.4
BUZ
  Top 0.254: R5.2 U1.29
DBG_RX
  Top 0.254: R8.1 UART.1
DBG_TX
  Top 0.254: R7.1 UART.3
ECHO_A
  Top 0.254: R23.2 R26.1 16.19,64.77 U1.25
ECHO_B
  Top 0.254: R27.1 R24.2 29.21,63.5 U1.27
ECL
  Top 0.406: IMU.6 48.9,15.24 52.07,12.06 X_I2C.2
EDA
  Top 0.406: IMU.5 46.35,15.24 49.53,12.06 X_I2C.1
ENC_AA
  Top 0.254: R32.2 R33.1 56.67,27.46 56.64,27.5 56.52,27.62 56.52,48.26 55.24,49.53 U1.10
ENC_AB
  Top 0.254: R34.2 R31.2 57.63,31.59 57.4,31.82 57.15,32.07 57.15,50.16 55.24,52.07 U1.11
ENC_BA
  Top 0.254: R28.2 R29.1 57.95,37.62 57.91,37.66 57.78,37.78 57.78,52.07 55.24,54.61 U1.12
ENC_BB
  Top 0.254: R30.2 R25.2 58.42,42.23 58.42,56.52 55.24,59.69 U1.14
ENC_BUT
  Top 0.254: R15.1 C6.1 33.02,77.15 U1.21
ENC_ROT_A
  Top 0.254: U1.22 28.57,76.83 R14.1 27.62,76.52 25.72,74.61 C7.1
ENC_ROT_B
  Top 0.254: C8.1 25.72,70.8 27.62,68.9 R13.1 31.75,68.58 U1.24
GND  (via drill 0.35, 1.5)
  Top 1.524: U3.4 2.54,29.21 | U3.4 6.51,33.18 | U3.4 10.95,29.21 | U3.4 6.51,25.56
  other vias: 23.5,14.61 21.11,15.4 21.11,14.61 21.11,13.81 20.32,14.61 20.32,15.4 20.32,13.81 19.53,14.61 19.53,15.4 19.53,13.81 27.46,15.4 27.46,14.61 27.46,13.81 26.67,14.61 26.67,15.4 26.67,13.81 25.88,14.61 25.88,15.4 25.88,13.81 24.77,46.35 24.77,47.62 24.77,48.9 22.23,46.35 22.23,47.62 22.23,48.9 22.23,62.23 22.23,60.96 22.23,59.69 24.77,62.23 24.77,60.96 24.77,59.69 20.95,74.93 20.95,73.66 20.95,72.39 20.95,71.12 29.84,74.3 29.84,73.03 29.84,71.75 29.84,70.48 22.23,92.71 22.23,91.44 22.23,90.17 26.04,90.81 26.04,89.53 26.04,88.27 34.92,97.16 36.2,97.16 37.47,97.16 38.73,97.16 40.01,97.16 41.27,97.16 33.66,93.34 34.92,93.34 36.2,93.34 42.55,93.34 37.47,93.34 47.62,93.34 50.16,93.34 50.16,97.16 51.44,97.16 35.56,32.38 36.2,33.02 36.83,33.66 38.73,31.75 38.1,31.11 37.47,30.48 64.14,27.3 64.14,28.57 65.41,27.3 65.41,28.57 54.61,32.38 54.61,31.11 54.61,29.84 54.61,28.57 54.61,27.3 50.8,19.05 54.61,45.09 54.61,43.81 54.61,42.55 59.69,45.09 59.69,43.81 59.69,42.55 29.84,78.11 30.48,77.47 31.11,76.83 26.04,82.55 26.04,81.28 26.04,80.01 22.23,85.72 22.23,87 21.59,87.63 20.95,88.27 18.41,84.45 18.41,83.19 18.41,81.92 18.41,80.64 17.14,84.45 17.14,83.19 17.14,81.92 17.14,80.64 9.53,69.85 9.53,68.58 9.53,67.31 18.41,66.67 19.05,67.31 18.41,67.94 19.68,66.67 30.48,67.31 30.48,66.04 29.21,67.31 29.21,66.04 6.35,57.78 6.35,56.52 7.62,57.78 7.62,56.52 15.88,53.34 14.61,53.34 14.61,52.07 15.88,52.07 8.89,46.99 10.16,48.26 11.43,46.99 10.16,46.99 5.71,43.18 6.99,43.18 6.99,41.91 5.71,41.91 8.26,43.18 8.26,41.91 4.45,43.18 4.45,41.91 13.34,35.56 14.61,35.56 14.61,34.29 13.34,34.29 16.51,33.02 16.51,31.75 16.51,30.48 19.05,32.38 19.05,31.11 20.32,31.11 20.32,29.84 20.32,28.57 19.05,28.57 19.05,29.84 31.11,22.86 32.38,22.86 33.66,22.86 34.92,22.86 31.11,24.13 32.38,24.13 33.66,24.13 34.92,24.13 31.11,18.41 32.38,18.41 33.66,18.41 34.92,18.41 31.11,17.14 29.84,17.14 32.38,17.14 33.66,17.14 46.99,10.16 46.99,8.89 46.99,7.62 46.99,6.35 45.72,6.35 45.72,7.62 45.72,8.89 45.72,10.16 55.24,10.16 56.52,10.16 57.78,10.16 59.05,10.16 59.05,8.89 57.78,8.89 56.52,8.89 55.24,8.89 64.77,56.52 64.77,55.24 66.04,56.52 66.04,55.24 67.31,56.52 67.31,55.24 69.22,70.48 64.14,71.75 69.22,71.75 64.14,69.22 64.14,70.48 69.22,69.22 62.23,78.74 62.23,77.47 63.5,78.74 63.5,77.47 53.98,80.01 55.24,80.01 55.24,78.74 53.98,78.74 53.98,77.47 55.24,77.47 46.35,83.19 47.62,83.19 47.62,81.92 46.35,81.92 46.35,80.64 47.62,80.64 41.27,80.64 42.55,80.64 42.55,79.38 41.27,79.38 41.27,78.11 42.55,78.11 34.92,80.64 36.2,80.64 36.2,79.38 34.92,79.38 34.92,78.11 36.2,78.11 5.71,24.13 6.99,24.13 6.99,22.86 5.71,22.86 8.26,24.13 8.26,22.86 38.73,13.97 39.37,14.61 39.37,13.34 40.01,22.86 40.64,23.5 40.01,18.41 41.27,18.41 45.72,24.13 46.99,24.13 46.99,22.86 45.72,22.86 48.26,30.48 48.9,29.84 41.91,34.92 40.64,34.92 41.27,36.2 42.55,36.2 38.1,42.55 35.56,40.01 35.56,41.27 35.56,42.55 38.1,43.81 47.62,40.64 47.62,41.91 46.35,41.91 37.47,64.14 38.73,64.14 38.73,62.87 37.47,62.87 37.47,61.59 38.73,61.59 53.98,58.42 53.98,57.15 53.98,55.88 48.26,57.15 48.26,55.88 48.26,54.61 45.09,71.75 46.35,71.75 47.62,71.75 52.07,19.05 53.34,19.05 54.61,22.23 54.61,20.95 54.61,19.68 57.15,19.68 57.15,20.95 57.15,22.23 59.05,34.29 58.1,34.29 59.05,31.43 58.74,39.37 59.05,57.15 57.78,58.42 58.42,57.78 20.95,62.23 19.68,62.23 26.04,62.23 27.3,62.23 19.05,40.01 20.32,36.83 19.68,37.47 19.05,38.73 15.24,43.18 16.51,43.18 16.51,41.91 15.24,41.91 22.23,22.23 21.59,21.59 22.86,21.59 63.5,46.35 63.5,47.62 63.5,48.9 1.91,59.05 1.91,57.78 1.91,56.52 1.91,55.24 71.75,56.52 71.75,55.24 71.75,43.81 71.75,42.55 69.22,43.81 69.22,42.55 71.75,71.75 71.75,70.48 55.88,84.45 56.52,83.82 57.15,83.19 57.78,82.55 59.69,84.45 59.05,85.09 58.42,85.72 57.78,86.36 71.75,28.57 71.75,27.3 8.89,73.66 7.62,73.66 6.35,73.66 4.13,31.43 4.13,29.21 4.13,26.99 6.67,26.99 6.67,29.21 6.67,31.43 8.89,31.43 8.89,29.21 8.89,26.99 7.94,30.16 5.4,30.16 5.4,28.26 7.94,28.26 1.59,33.97 1.59,33.02 2.54,33.97 2.54,33.02 3.49,33.02 3.49,33.97 4.45,22.86 4.45,24.13
  pour Bottom (rank 2): 0,0 73.66,0 73.66,99.06 0,99.06
  pour Top (isolate 0.254, no thermals): 19.05,17.78 27.94,17.78 27.94,11.43 19.05,11.43
  pour Top (rank 2): 0,0 73.66,0 73.66,99.06 0,99.06
IMU_INT
  Top 0.254: IMU.8 55.88,18.41 55.88,46.35 55.24,46.99 U1.9
IMU_SCL  (via drill 0.35)
  Top 0.254: U1.2 52.07,27.94 v52.07,24.13 | IMU.3 43.18,18.41 44.45,18.41 v49.53,23.5
  Top 0.406: R37.2 IMU.3
  Bottom 0.254: v52.07,24.13 50.16,24.13 v49.53,23.5
IMU_SDA
  Top 0.254: U1.1 50.8,23.5 IMU.4
  Top 0.406: R35.2 IMU.4
N$1
  Top 0.406: R22.2 19.37,12.87 22.24,12.87 22.52,12.59 U2.3
N$2
  Top 0.406: R21.2 27.62,12.87 24.75,12.87 24.47,12.59 U2.6
N$3
  Top 0.406: C13.2 26.35,21.27 24.48,19.4 U2.11
N$4
  Top 0.406: U2.14 22.52,16.62 22.24,16.34 17.63,16.34 C12.1
N$8
  Top 0.813: POWER.1 8.26,15.88 12.23,19.86 T1.3
N$9
  Bottom 0.254: R12.1 43.18,67.62 43.18,63.91 PWR.C
N$10
  Bottom 0.254: TX.C 45.41,61.69 R11.1
N$11  (via drill 0.35)
  Top 0.254: SW1.1 6.97,85.71 v11.43,90.17 | R20.2 v19.68,90.17 20.64,90.17 R15.2
  Bottom 0.254: v19.68,90.17 v11.43,90.17
N$12
  Top 0.254: R5.1 25.72,56.69 T3.B
N$13
  Top 0.254: R14.2 25.09,77.47 25.09,80.17 SW1.A 21.47,86.48 17.14,90.81 R19.2
N$14
  Top 0.406: SG1.- 19.05,58.42 T3.C
N$15
  Top 0.254: R13.2 24.13,68.58 22.86,69.85 22.86,77.39 SW1.B 19.68,80.56 19.68,86.68 14.61,91.76 R16.2
N$20
  Bottom 0.254: R10.1 43.81,65.72 43.81,62.01 RX.C
N$23
  Top 0.254: HC_SR04_A.3 10.48,66.04 R26.2
N$24
  Top 0.254: R27.2 11.75,54.93 7.62,50.8 HC_SR04_B.3
N$25
  Top 0.254: R34.1 61.91,26.57 64.24,24.24 64.24,19.58 64.77,19.05 ENCODER_A.3
N$26
  Top 0.254: R33.2 62.87,24.13 63.5,23.5 63.5,19.05 66.04,16.51 ENCODER_A.4
N$27
  Top 0.254: ENCODER_B.3 67.18,34.29 63.37,38.1 R30.1
N$28
  Top 0.254: ENCODER_B.4 67.18,31.75 63.37,35.56 R29.2
N$30
  Top 0.254: R3.1 37.78,88.9 DEBUG.1 33.02,90.81 DEBUG2.1
N$32
  Top 0.254: SERVO_A.1 R36.1
N$33
  Top 0.254: R2.2 39.37,82.55 36.83,85.09 30.48,85.09 27.94,87.63 DEBUG.3 27.94,90.81 DEBUG2.3
NCS
  Top 0.406: PAD3.1 IMU.9
NEOPIXEL  (via drill 0.5)
  Top 0.406: v40.01,46.99 41.91,45.09 NEOPIXEL.2
  Bottom 0.406: U1.32 v40.01,46.99
OLED_SCL
  Top 0.254: U1.20 50.8,86.36 49.22,87.94 R4.2 48.9,89.22 OLED.3
OLED_SDA  (via drill 0.35)
  Top 0.254: v49.53,78.74 49.53,85.41 R1.2 46.35,89.22 OLED.4
  Bottom 0.254: U1.19 52.07,73.66 52.07,76.2 v49.53,78.74
RUN
  Bottom 0.406: RST.1 U1.30
SERV_A
  Top 0.254: R36.2 60.01,57.47 55.24,62.23 U1.15
SWCLK
  Top 0.254: R3.2 U1.41
SWDIO
  Top 0.254: U1.43 R2.1
TRIG_A
  Top 0.254: HC_SR04_A.2 7.62,63.5 8.89,64.77 14.61,64.77 15.24,64.14 31.11,64.14 U1.26
TRIG_B
  Top 0.254: HC_SR04_B.2 8.89,48.26 11.43,50.8 31.75,50.8 U1.31
UART_RX
  Top 0.254: U1.17 52.07,67.31 | 52.07,67.31 R8.2 | R9.2 57.15,62.23 52.07,67.31
  Bottom 0.254: R10.2 U1.17
UART_TX
  Top 0.254: R7.2 58.42,78.74 58.42,74.38 52.62,68.58 50.15,68.58 49.53,67.96 49.53,66.04 U1.16 53.89,64.77 56.64,62.02 58.97,59.69 R6.2
  Bottom 0.254: R11.2 U1.16
V+  (via drill 0.35)
  Top 0.406: 17.78,26.93 v17.78,29.21 | v17.78,41.91 19.68,43.81 R18.1 | 23.81,20 U2.12
  Top 0.61: 18.98,23.18 C1.+
  Top 0.813: T1.2 18.98,23.18 | U3.1 17.78,26.93 24.19,26.93 C11.1 C2.1 | C1.+ 20.7,23.24 21.59,24.13 C2.1 | C2.1 C13.1 23.81,20.95 23.81,20
  Bottom 0.406: v17.78,29.21 v17.78,41.91
VBUS
  Top 0.406: T2.1 16.19,37.15 21.59,31.75 26.04,31.75 31.11,26.67 U1.40

### Text on the board
tPlace: SC | SD | GND | RX | GND | TX | BalanceBot v1.0 | JLCJLCJLCJLC
bPlace: +5V | GND | TRIG | ECHO | GND | +5V | RX | TX | GND | TRIG | PWM | ECHO | +5V | +5V | GND | +5V | DOUT | GND | +5V | BalanceBot v1.0 | GND | B | A | M. Pawłowski / J. Bulik | AGH 2023 | +5V | LI-ION 2S | GND | B | A | 1 | 2 | 2 | 1